# EasyEDA schematic SCH_ERangerBeads_2023-05-25.json
TITLE: Sheet_1; REV: 1.0; Date: 2022-08-18; Sheet: 1/1; Drawn By: nsidebot; Company: Your Company
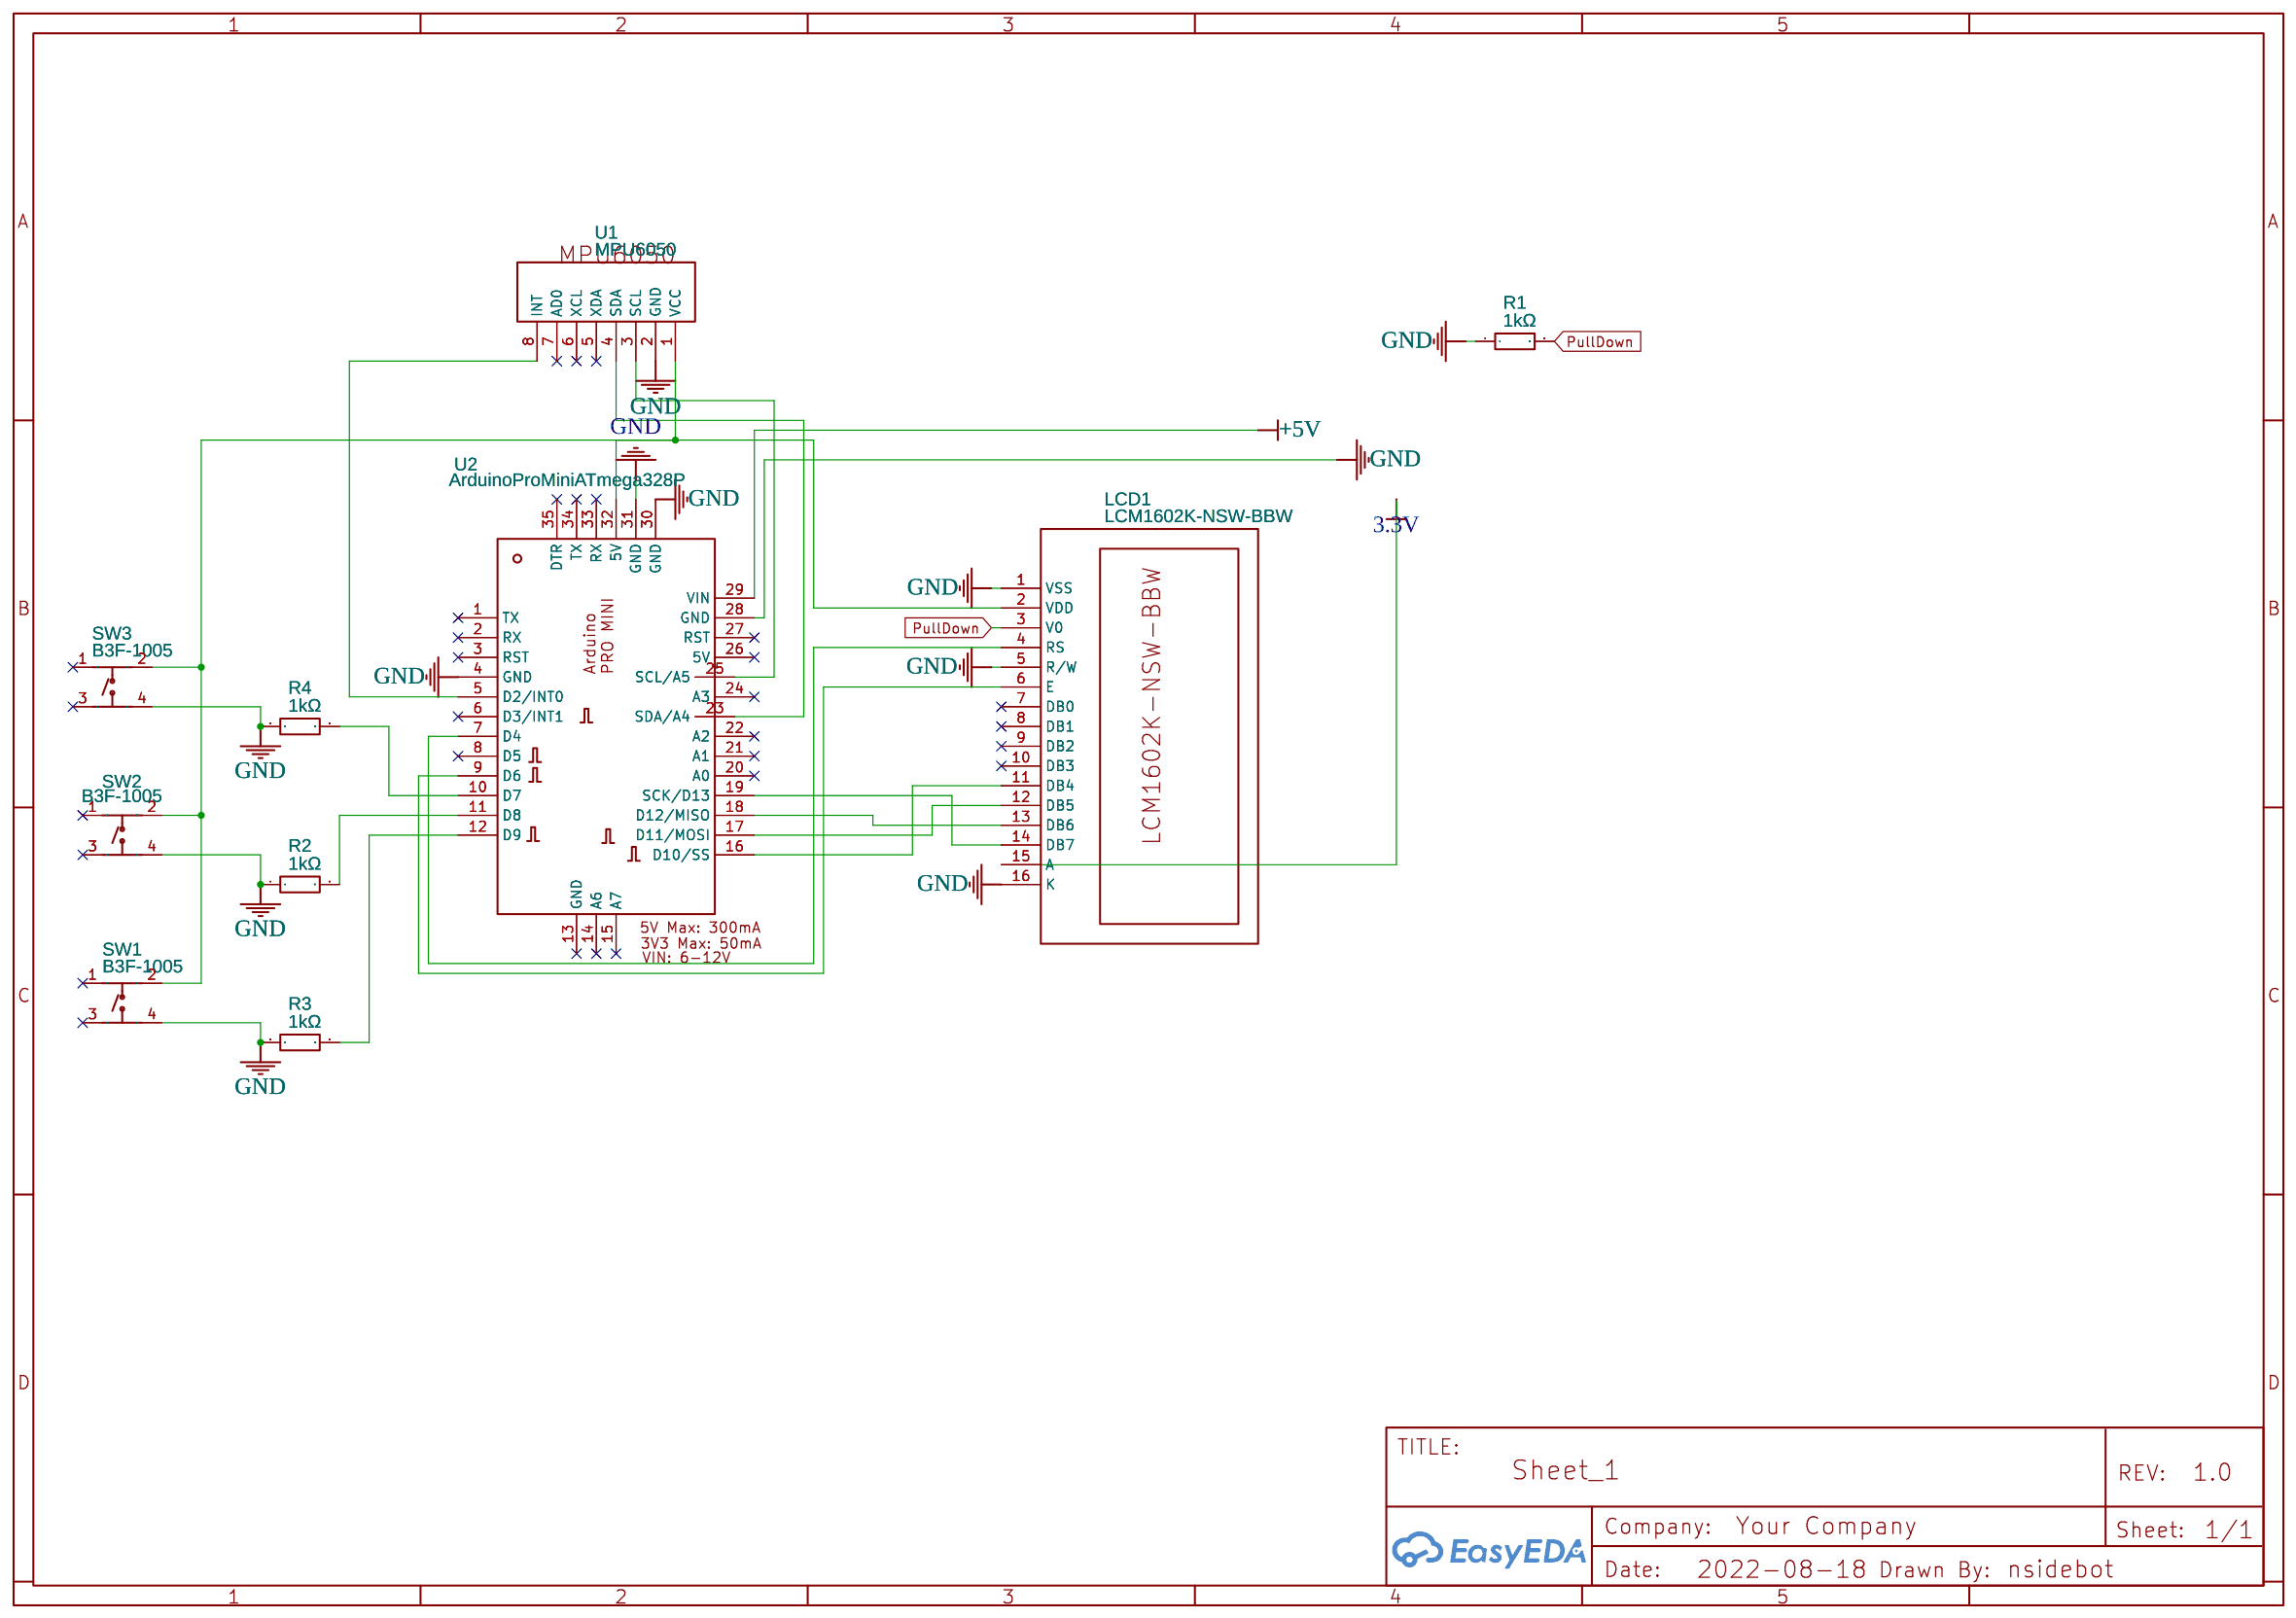
[diagram p0: schematic sheet]

## Parts
LCD1  LCM1602K-NSW-BBW  [MODULE-TH_LCM1602K]
R1  1kΩ  [R0603]
R2  1kΩ  [R0603]
R3  1kΩ  [R0603]
R4  1kΩ  [R0603]
SW1  B3F-1005  [KEY-SMD_4P-L6.0-W6.6-P4.50-LS6.5]
SW2  B3F-1005  [KEY-SMD_4P-L6.0-W6.6-P4.50-LS6.5]
SW3  B3F-1005  [KEY-SMD_4P-L6.0-W6.6-P4.50-LS6.5]
U1  MPU6050  [MPU6050]
U2  ArduinoProMiniATmega328P  [ARDUINOPROMINI]

## Library data of the parts
LCD1 = LCM1602K-NSW-BBW: Supplier: LCSC; Manufacturer: LONTECH; Supplier Part: C83275; JLCPCB Part Class: Extended Part
R1-R4 = 0603WAJ0102T5E: Supplier: LCSC; Manufacturer: UniOhm; Supplier Part: C25585; Resistance (Ohms): 1K; JLCPCB Part Class: Extended Part
SW1-SW3 = B3F-1005: Supplier: LCSC; Supplier Part: C397293; Manufacturer: Omron Electronics; Contributor: LCSC; JLCPCB Part Class: Extended Part
U1 = MPU6050: Contributor: Myk-13
U2 = ArduinoProMiniATmega328P: Contributor: BauerTechnology

## Nets
3.3V: LCD1.15(A)
+5V: U2.29(VIN)
GND: LCD1.1(VSS) LCD1.5(R/W) LCD1.16(K) R1.1 R2.1 R3.1 R4.1 SW1.4 SW2.4 SW3.4 U1.2(GND) U2.4(GND) U2.28(GND) U2.30(GND) U2.31(GND)
PullDown: LCD1.3(V0) R1.2
Net-(LCD1-2): LCD1.2(VDD) SW1.2 SW2.2 SW3.2 U1.1(VCC) U2.32(5V)
Net-(LCD1-4): LCD1.4(RS) U2.7(D4)
Net-(LCD1-6): LCD1.6(E) U2.9(D6)
Net-(LCD1-11): LCD1.11(DB4) U2.16(D10/SS)
Net-(LCD1-12): LCD1.12(DB5) U2.17(D11/MOSI)
Net-(LCD1-13): LCD1.13(DB6) U2.18(D12/MISO)
Net-(LCD1-14): LCD1.14(DB7) U2.19(SCK/D13)
Net-(R2-2): R2.2 U2.11(D8)
Net-(R3-2): R3.2 U2.12(D9)
Net-(R4-2): R4.2 U2.10(D7)
Net-(U1-3): U1.3(SCL) U2.25(SCL/A5)
Net-(U1-4): U1.4(SDA) U2.23(SDA/A4)
Net-(U1-8): U1.8(INT) U2.5(D2/INT0)

Not connected (* = marked no-connect by the designer): LCD1 7(DB0)* 8(DB1)* 9(DB2)* 10(DB3)*; SW1 1* 3*; SW2 1* 3*; SW3 1* 3*; U1 5(XDA)* 6(XCL)* 7(AD0)*; U2 1(TX)* 2(RX)* 3(RST)* 6(D3/INT1)* 8(D5)* 13(GND)* 14(A6)* 15(A7)* 20(A0)* 21(A1)* 22(A2)* 24(A3)* 26(5V)* 27(RST)* 33(RX)* 34(TX)* 35(DTR)*
